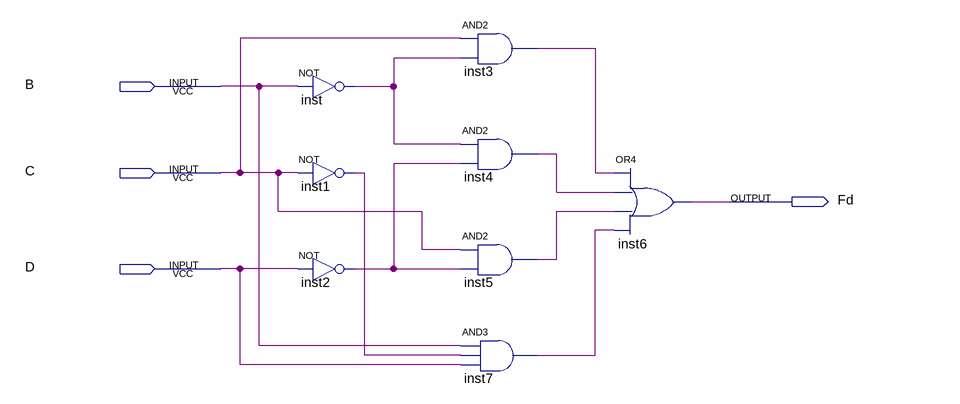
[diagram p0: schematic sheet]
// Quartus schematic Fd.bdf as structural Verilog: 8 symbols, 4 pins
module Fd (
  input  B,
  input  C,
  input  D,
  output Fd
);

  wire inst1_out, inst2_out, inst3_out, inst4_out, inst5_out, inst7_out, inst_out;

  not inst (inst_out, B);
  not inst1 (inst1_out, C);
  not inst2 (inst2_out, D);
  and inst3 (inst3_out, C, inst_out);
  and inst4 (inst4_out, inst_out, inst2_out);
  and inst5 (inst5_out, C, inst2_out);
  and inst7 (inst7_out, B, inst1_out, D);
  or inst6 (Fd, inst3_out, inst4_out, inst5_out, inst7_out);
endmodule
